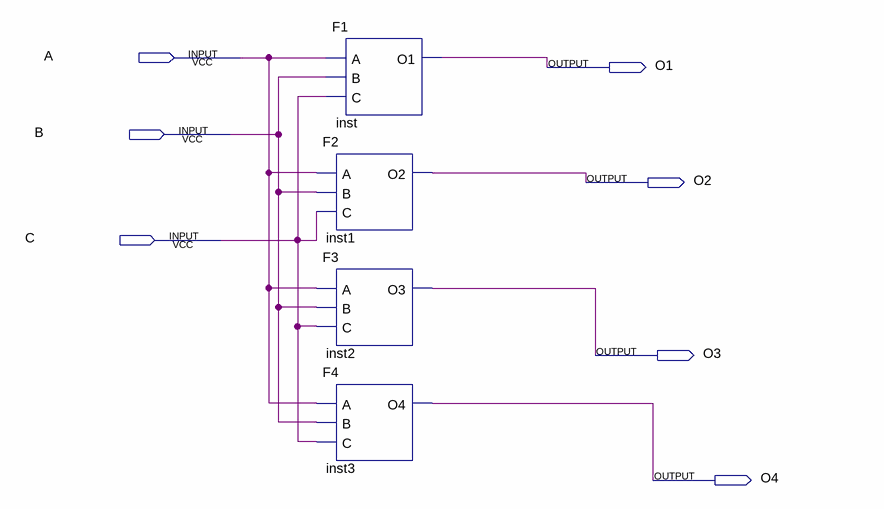
[diagram p0: schematic sheet]
// Quartus schematic ID_hocsinh.bdf as structural Verilog: 4 symbols, 7 pins
module ID_hocsinh (
  input  A,
  input  B,
  input  C,
  output O1,
  output O2,
  output O3,
  output O4
);

  F1 inst (.A(A), .B(B), .C(C), .O1(O1));
  F2 inst1 (.A(A), .B(B), .C(C), .O2(O2));
  F3 inst2 (.A(A), .B(B), .C(C), .O3(O3));
  F4 inst3 (.A(A), .B(B), .C(C), .O4(O4));
endmodule
